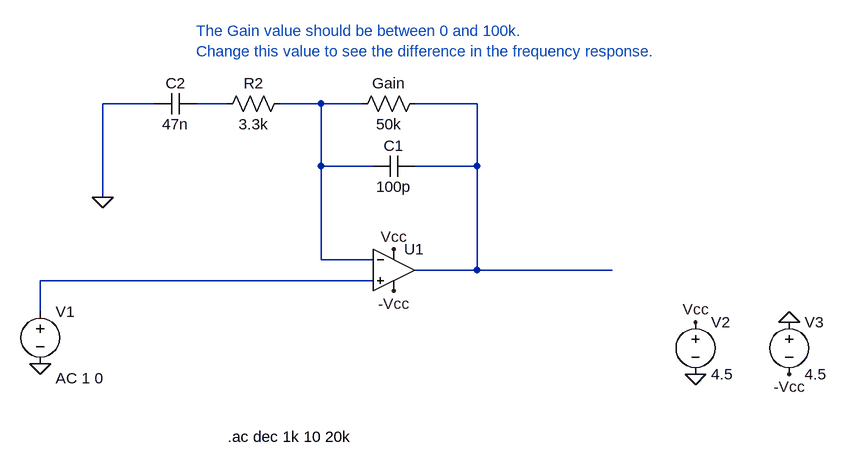
[diagram p0: schematic op-amp1.asc]
op-amp1.asc, the LTspice schematic file:
Version 4
SHEET 1 1200 680
WIRE 160 32 80 32
WIRE 272 32 224 32
WIRE 416 32 352 32
WIRE 480 32 416 32
WIRE 656 32 560 32
WIRE 416 128 416 32
WIRE 496 128 416 128
WIRE 656 128 656 32
WIRE 656 128 560 128
WIRE 80 176 80 32
WIRE 416 272 416 128
WIRE 496 272 416 272
WIRE 656 288 656 128
WIRE 656 288 560 288
WIRE 864 288 656 288
WIRE 496 304 -16 304
WIRE -16 352 -16 304
FLAG 992 448 0
FLAG 1136 368 0
FLAG 992 368 Vcc
FLAG 1136 448 -Vcc
FLAG 528 320 -Vcc
FLAG 528 256 Vcc
FLAG -16 432 0
FLAG 80 176 0
SYMBOL OpAmps/UniversalOpAmp 528 288 R0
SYMATTR InstName U1
SYMBOL voltage -16 336 R0
WINDOW 123 24 118 Left 2
SYMATTR Value2 AC 1 0
SYMATTR InstName V1
SYMATTR Value ""
SYMBOL voltage 992 352 R0
SYMATTR InstName V2
SYMATTR Value 4.5
SYMBOL voltage 1136 352 R0
SYMATTR InstName V3
SYMATTR Value 4.5
SYMBOL cap 560 112 R90
WINDOW 0 0 32 VBottom 2
WINDOW 3 32 32 VTop 2
SYMATTR InstName C1
SYMATTR Value 100p
SYMBOL res 576 16 R90
WINDOW 0 0 56 VBottom 2
WINDOW 3 32 56 VTop 2
SYMATTR InstName Gain
SYMATTR Value 50k
SYMBOL res 368 16 R90
WINDOW 0 0 56 VBottom 2
WINDOW 3 32 56 VTop 2
SYMATTR InstName R2
SYMATTR Value 3.3k
SYMBOL cap 224 16 R90
WINDOW 0 0 32 VBottom 2
WINDOW 3 32 32 VTop 2
SYMATTR InstName C2
SYMATTR Value 47n
TEXT 272 544 Left 2 !.ac dec 1k 10 20k
TEXT 224 -80 Left 2 ;The Gain value should be between 0 and 100k.\nChange this value to see the difference in the frequency response.

The netlist it stands for:
* op-amp1.asc
XU1 N004 N002 Vcc -Vcc N003 level1 Avol=1Meg GBW=10Meg Vos=0 En=0 Enk=0 In=0 Ink=0 Rin=500Meg  ; pins In+ In- V+ V- OUT
V1 N004 0 AC 1 0
V2 Vcc 0 4.5
V3 0 -Vcc 4.5
C1 N003 N002 100p
R§Gain N003 N002 50k
R2 N002 N001 3.3k
C2 N001 0 47n
.ac dec 1k 10 20k
* The Gain value should be between 0 and 100k.
* Change this value to see the difference in the frequency response.
.lib UniversalOpAmp1.lib
.backanno
.end